# Altium project CowHeater_PCB.PrjPcb
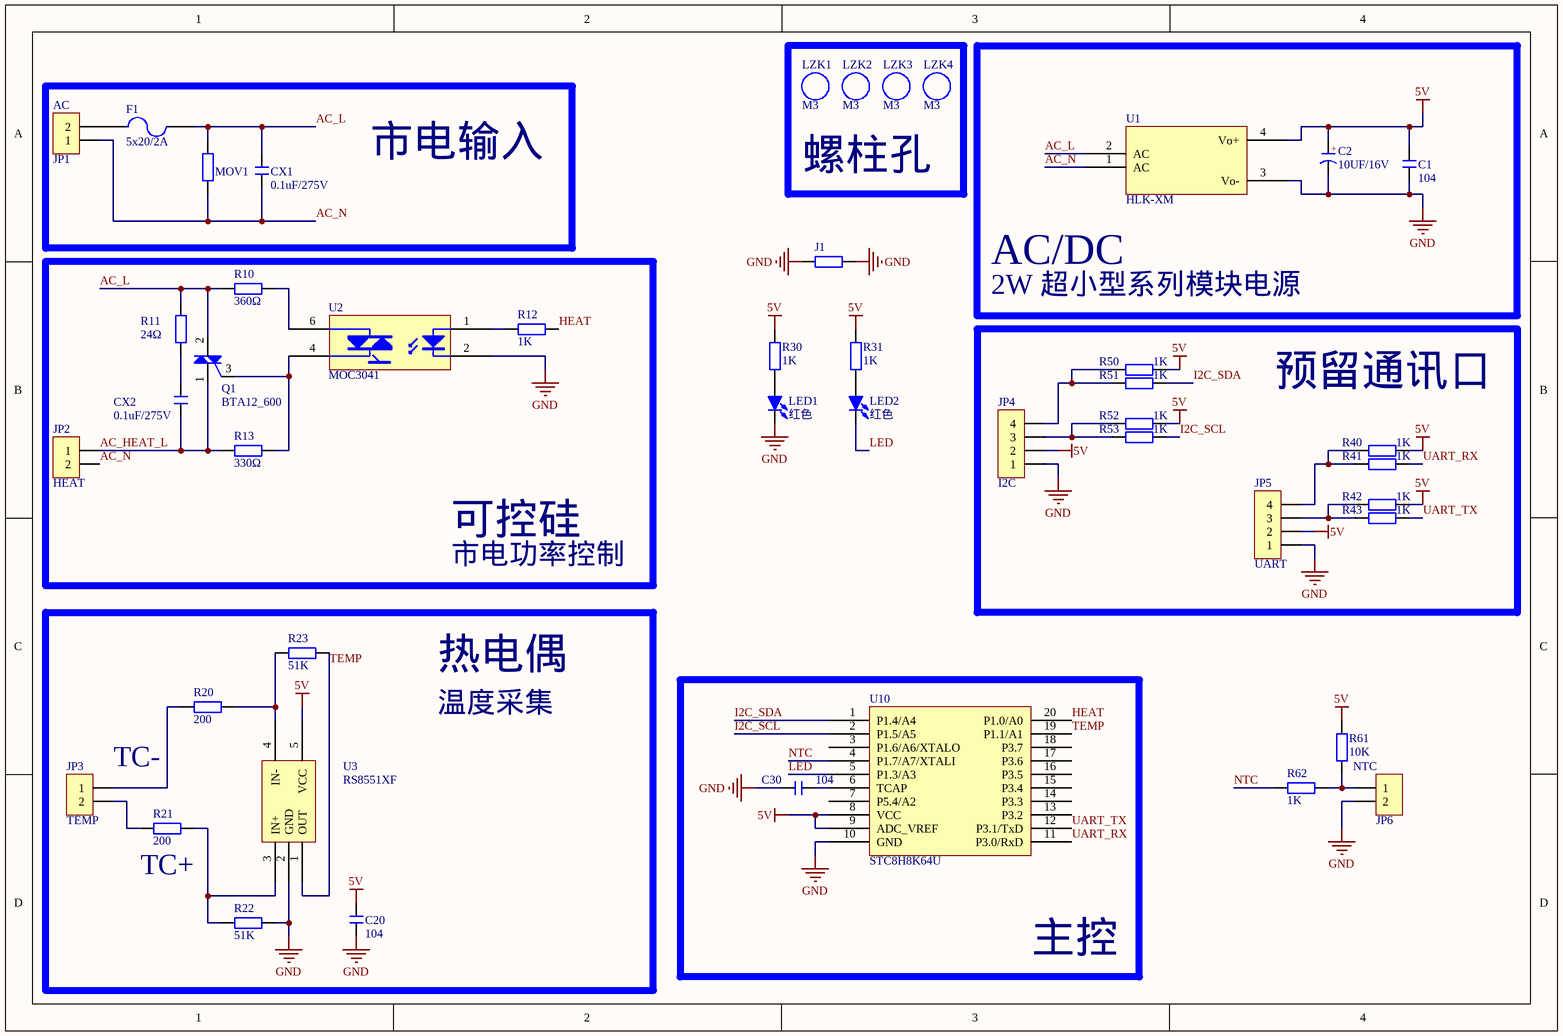
[diagram p0: CowHeater_SCH.SchDoc]
1 sheet, 46 parts. Net scope: global (net labels, ports and power ports of the same name join across sheets).
Board file: CowHeater_PCB.PcbDoc

## Sheet CowHeater_SCH.SchDoc
size A4

### Parts
C1  104  [C 0603]
C2  10UF/16V  [CAP 3.5*8*11.5]
C20  104  [C 0603]
C30  104  [C 0603]
CX1  0.1uF/275V  [CX 10*13*11]
CX2  0.1uF/275V  [CX 10*13*11]
F1  5x20/2A  [FU BLX-A]
J1  1K  [R 0603]  (value not drawn)
JP1  AC  [KF7620-2P]
JP2  HEAT  [KF7620-2P]
JP3  TEMP  [KF301-2P]
JP4  I2C  [XH2.54-4P]
JP5  UART  [XH2.54-4P]
JP6  NTC  [XH2.54-2P]
LED1  红色  [LED 0603W]
LED2  红色  [LED 0603W]
LZK1  M3  [M3 125X300]
LZK2  M3  [M3 125X300]
LZK3  M3  [M3 125X300]
LZK4  M3  [M3 125X300]
MOV1  1K  [RES-10-561(TVR)]  (value not drawn)
Q1  BTA12_600  [TO220_OUT5]
R10  360Ω  [RS 1W-F5]
R11  24Ω  [RS 1W-F5]
R12  1K  [R 0603]
R13  330Ω  [RS 1W-F5]
R20  200  [R 0603]
R21  200  [R 0603]
R22  51K  [R 0603]
R23  51K  [R 0603]
R30  1K  [R 0603]
R31  1K  [R 0603]
R40  1K  [R 0603]
R41  1K  [R 0603]
R42  1K  [R 0603]
R43  1K  [R 0603]
R50  1K  [R 0603]
R51  1K  [R 0603]
R52  1K  [R 0603]
R53  1K  [R 0603]
R61  10K  [R 0603]
R62  1K  [R 0603]
U1  HLK-XM  [HLK_5M]
U2  MOC3041  [DIP6-300]
U3  RS8551XF  [SOT23-5N]
U10  STC8H8K64U  [TSSOP20_N]

### Blocks framed on the sheet
市电输入: CX1 F1 JP1 MOV1
螺柱孔: LZK1-LZK4
AC/DC: C1 C2 U1
可控硅: CX2 JP2 Q1 R10-R13 U2
预留通讯口: JP4 JP5 R40-R43 R50-R53
热电偶: C20 JP3 R20-R23 U3
主控: C30 U10

### Nets
5V: C1.2 C2.1(A) C20.2 JP4.2 JP5.2 R30.2 R31.2 R40.1 R42.1 R50.1 R52.1 R61.1 U1.4(Vo+) U3.5(VCC) U10.8(VCC) U10.9(ADC_VREF)
GND: C1.1 C2.2(K) C20.1 C30.2 J1.1 J1.2 JP4.1 JP5.1 JP6.2 LED1.2(K) R22.2 U1.3(Vo-) U2.2 U3.2(GND) U10.10(GND)
AC_HEAT_L: CX2.1 JP2.1 Q1.1(A2) R13.1
AC_L: CX1.1 F1.2 MOV1.2 Q1.2(A1) R10.1 R11.2 U1.2(AC)
AC_N: CX1.2 JP1.1 JP2.2 MOV1.1 U1.1(AC)
HEAT: R12.2 U10.20(P1.0/A0)
I2C_SCL: R53.1 U10.2(P1.5/A5)
I2C_SDA: R51.1 U10.1(P1.4/A4)
LED: LED2.2(K) U10.5(P1.3/A3)
NTC: R62.1 U10.4(P1.7/A7/XTALI)
TEMP: R23.2 U3.1(OUT) U10.19(P1.1/A1)
UART_RX: R41.1 U10.11(P3.0/RxD)
UART_TX: R43.1 U10.12(P3.1/TxD)
NetC30_1: C30.1 U10.6(TCAP)
NetCX2_2: CX2.2 R11.1
NetF1_1: F1.1 JP1.2
NetJP3_1: JP3.1 R20.1
NetJP3_2: JP3.2 R21.1
NetJP4_3: JP4.3 R52.2 R53.2
NetJP4_4: JP4.4 R50.2 R51.2
NetJP5_3: JP5.3 R42.2 R43.2
NetJP5_4: JP5.4 R40.2 R41.2
NetJP6_1: JP6.1 R61.2 R62.2
NetLED1_1: LED1.1(A) R30.1
NetLED2_1: LED2.1(A) R31.1
NetQ1_3: Q1.3(G) R13.2 U2.4
NetR10_2: R10.2 U2.6
NetR12_1: R12.1 U2.1
NetR20_2: R20.2 R23.1 U3.4(IN-)
NetR21_2: R21.2 R22.1 U3.3(IN+)

Not connected (* = marked no-connect by the designer): U10 3(P1.6/A6/XTALO) 7(P5.4/A2) 13(P3.2) 14(P3.3) 15(P3.4) 16(P3.5) 17(P3.6) 18(P3.7)

### Notes on the sheet
- 2W 超小型系列模块电源
- 市电功率控制
- 温度采集
- (near JP3) TC-
- (near R21) TC+
- (in symbol C-CAP) +

### Library data of the parts
C1 C20 C30 = C: 无极性贴片电容; 版权归属: 源创客; BOM名称: 无极性贴片电容; 学习资源: www.ooocke.com
C2 = C-CAP: 直插电解电容; 版权归属: 源创客; BOM名称: 直插电解电容; 学习资源: www.ooocke.com
CX1 CX2 = C-CX: X电容; 版权归属: 源创客; BOM名称: X电容; 学习资源: www.ooocke.com
F1 = FU 5x20: 5*20保险丝; 版权归属: 源创客; BOM名称: 5*20保险丝; 学习资源: www.ooocke.com
J1 R12 R20-R23 R30 R31 R40-R43 R50-R53 R61 R62 = R: 贴片电阻; 版权归属: 源创客; BOM名称: 贴片电阻; 学习资源: www.ooocke.com
JP1-JP3 JP6 = Header 2: 2P接插件; 版权归属: 源创客; BOM名称: 2P接插件; 学习资源: www.ooocke.com
JP4 JP5 = Header 4: 4P接插件; 版权归属: 源创客; BOM名称: 4P接插件; 学习资源: www.ooocke.com
LED1 LED2 = LED-SMD: 贴片LED; 版权归属: 源创客; BOM名称: 贴片LED; 学习资源: www.ooocke.com
LZK1-LZK4 = M3: 铜柱孔; 版权归属: 源创客; BOM名称: 铜柱孔; 学习资源: www.ooocke.com
MOV1 = MOV: 压敏电阻; BOM名称: 贴片电阻; 版权归属: 源创客; 学习资源: www.ooocke.com
Q1 = BTA12_600: 双向可控硅; 版权归属: 源创客; BOM名称: 双向可控硅; 学习资源: www.ooocke.com
R10 R11 R13 = R-CRR: 直插色环电阻; BOM名称: 色环电阻; 版权归属: 源创客; 学习资源: www.ooocke.com
U1 = HLK-XM: 超小型系列模块电源
U3 = RS8551XF: 零漂移,1uV Vos,4.5MHz,1通道运放